# EAGLE design button8x-analog-v1 (EAGLE 8.7.1)
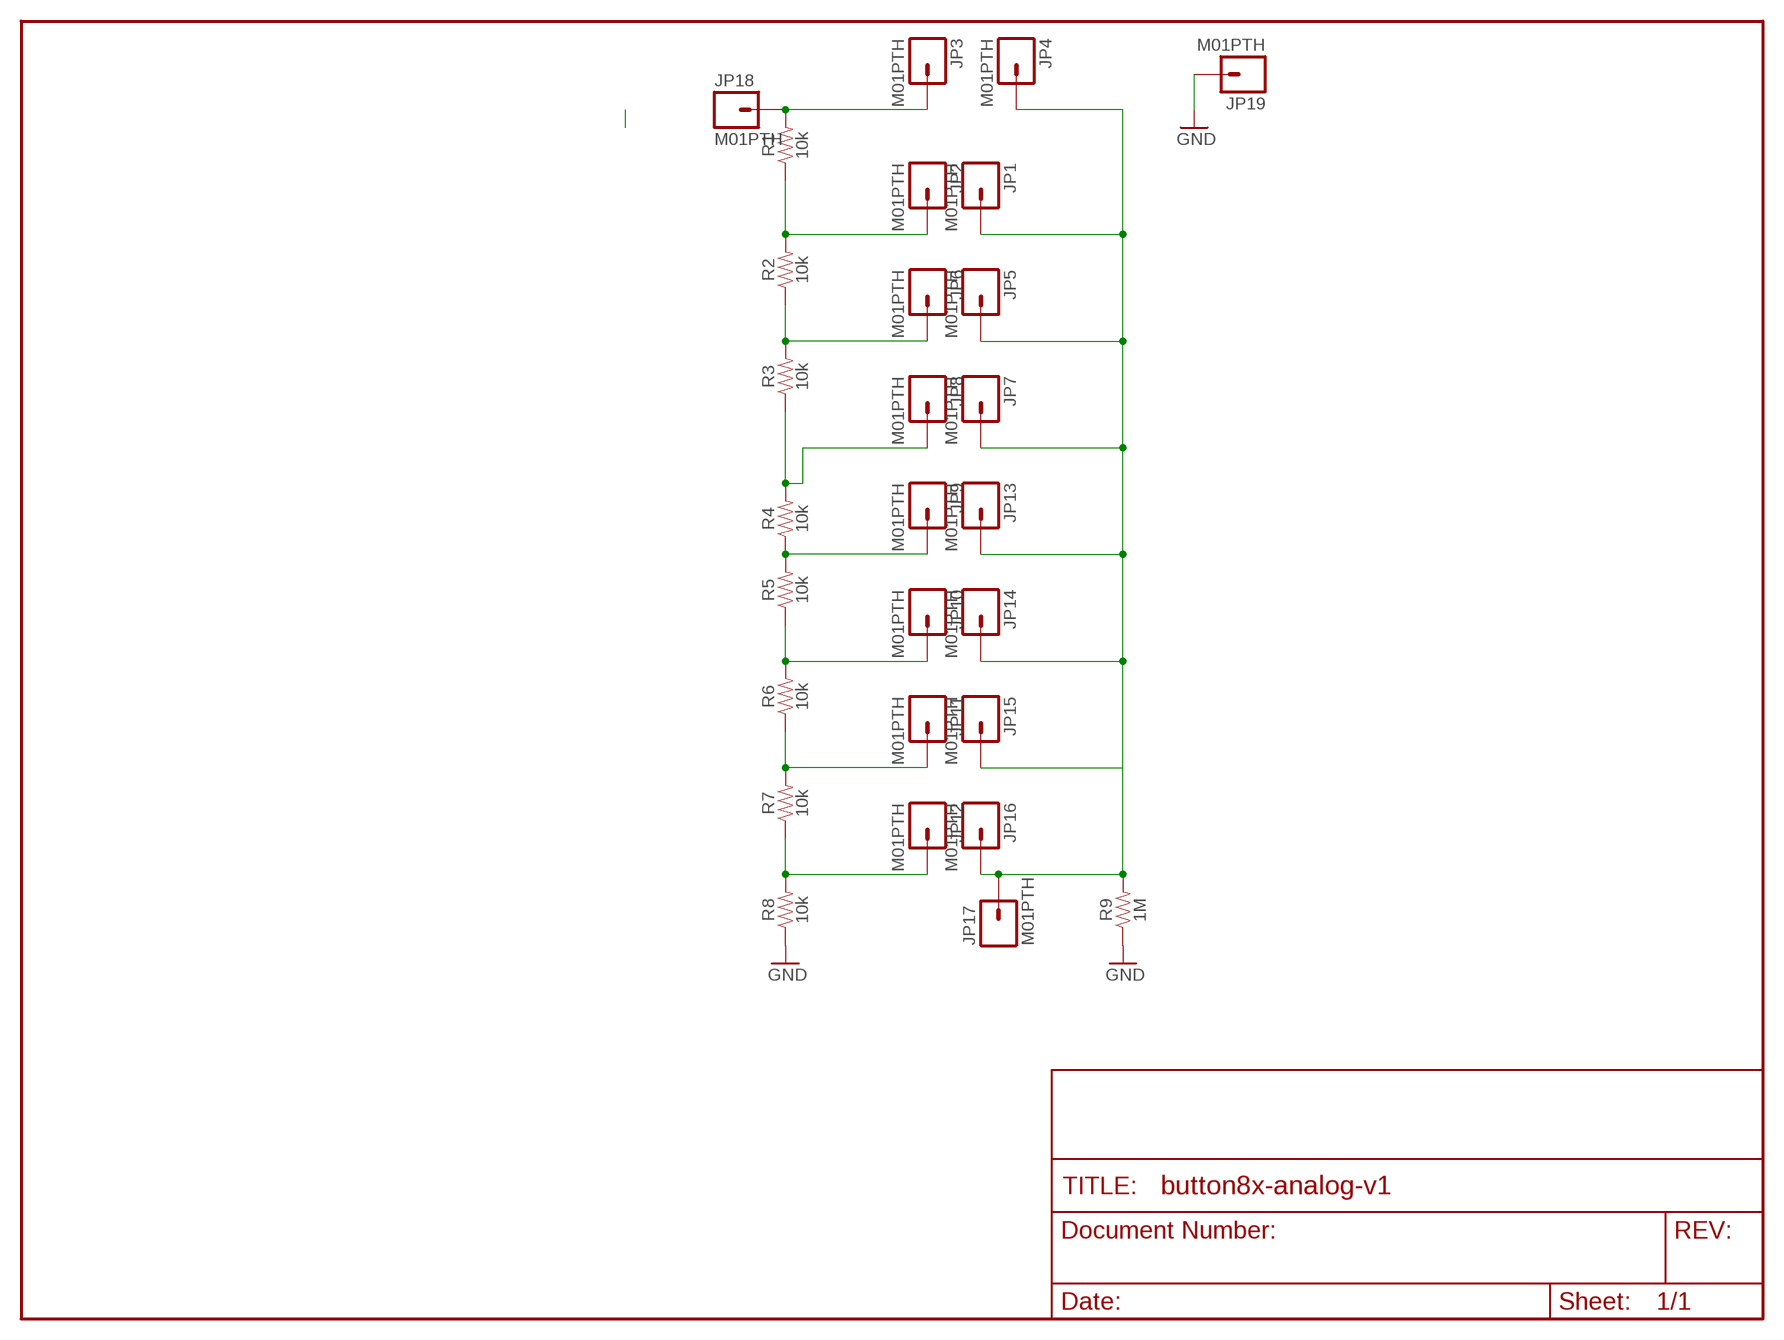
[diagram p0: schematic, sheet 1]

## Parts
JP1  M01PTH  [1X01]
JP2  M01PTH  [1X01]
JP3  M01PTH  [1X01]
JP4  M01PTH  [1X01]
JP5  M01PTH  [1X01]
JP6  M01PTH  [1X01]
JP7  M01PTH  [1X01]
JP8  M01PTH  [1X01]
JP9  M01PTH  [1X01]
JP10  M01PTH  [1X01]
JP11  M01PTH  [1X01]
JP12  M01PTH  [1X01]
JP13  M01PTH  [1X01]
JP14  M01PTH  [1X01]
JP15  M01PTH  [1X01]
JP16  M01PTH  [1X01]
JP17  M01PTH  [1X01]
JP18  M01PTH  [1X01]
JP19  M01PTH  [1X01]
R1  10k  10KOHM-0603-1/10W-1%  [0603]
R2  10k  10KOHM-0603-1/10W-1%  [0603]
R3  10k  10KOHM-0603-1/10W-1%  [0603]
R4  10k  10KOHM-0603-1/10W-1%  [0603]
R5  10k  10KOHM-0603-1/10W-1%  [0603]
R6  10k  10KOHM-0603-1/10W-1%  [0603]
R7  10k  10KOHM-0603-1/10W-1%  [0603]
R8  10k  10KOHM-0603-1/10W-1%  [0603]
R9  1M  10KOHM-0603-1/10W-1%  [0603]

## Nets
ANALOG: JP1.1 JP4.1 JP5.1 JP7.1 JP13.1 JP14.1 JP15.1 JP16.1 JP17.1 R9.2
GND: JP19.1 R8.1 R9.1
N$4: JP2.1 R1.1 R2.2
N$5: JP6.1 R2.1 R3.2
N$6: JP8.1 R3.1 R4.2
N$7: JP9.1 R4.1 R5.2
N$9: JP11.1 R6.1 R7.2
N$10: JP12.1 R7.1 R8.2
N$11: JP10.1 R5.1 R6.2
VCC: JP3.1 JP18.1 R1.2

## Library data of the parts
JP1-JP19 = SparkFun-Connectors:M01: Header 1 Standard 1-pin 0.1" header. Use with straight break away headers (SKU : PRT-00116), right angle break away headers (PRT-00553), swiss pins (PRT-00743), machine pins (PRT-00117), and female headers (PRT-00115).
R1-R8 = SparkFun-Resistors:10KOHM: 10kΩ resistor A resistor is a passive two-terminal electrical component that implements electrical resistance as a circuit element. Resistors act to reduce current flow, and, at the same time, act to lower voltage levels within circuits. - Wikipedia; PROD_ID: RES-00824
R9 = SparkFun-Resistors:10KOHM: 10kΩ resistor A resistor is a passive two-terminal electrical component that implements electrical resistance as a circuit element. Resistors act to reduce current flow, and, at the same time, act to lower voltage levels within circuits. - Wikipedia; PROD_ID: RES-00824; VALUE: 10k

## Net classes
0 default: width 0.203 mm
1 vcc: width 0.254 mm

## Board
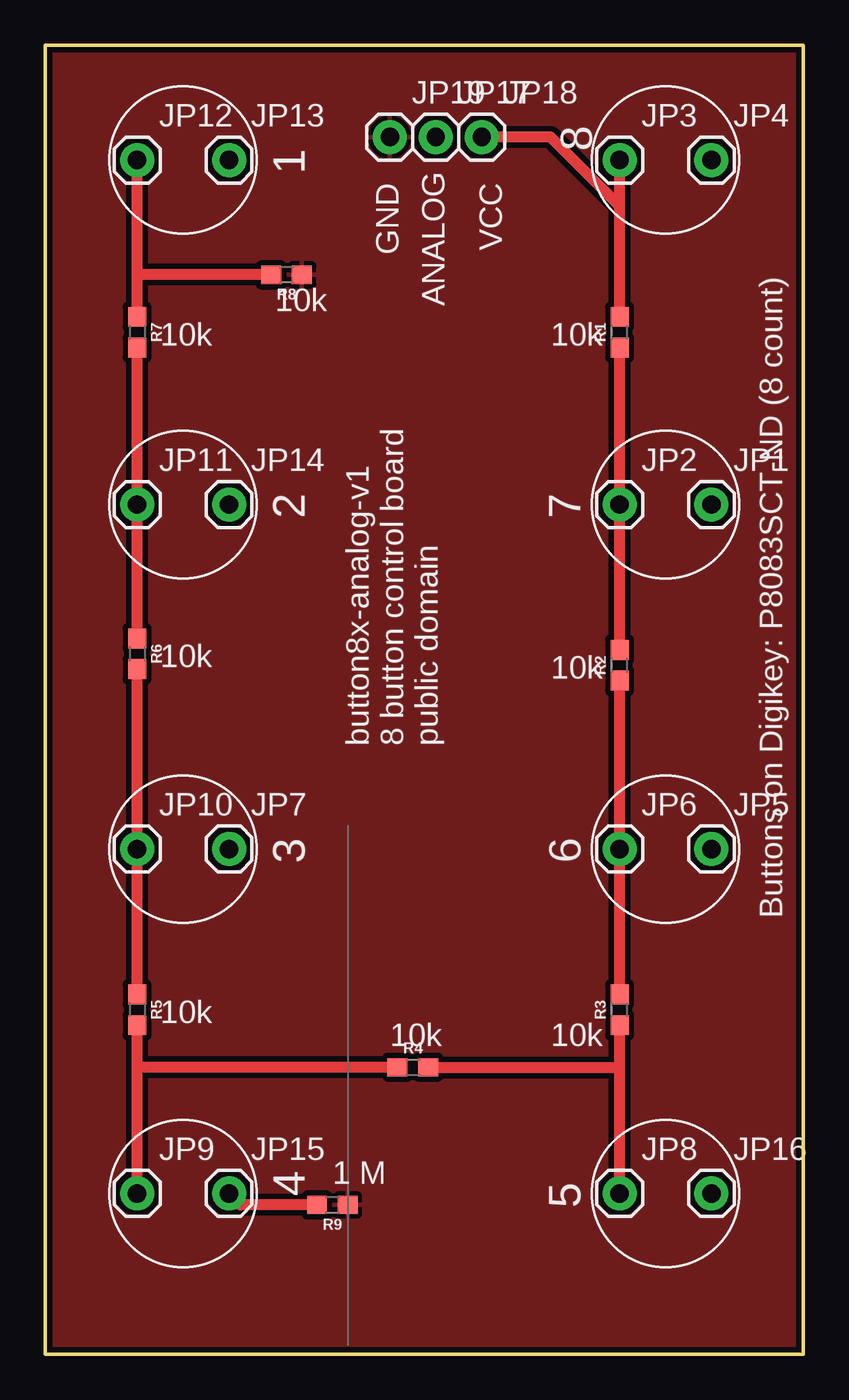
[diagram p1: board, top side]
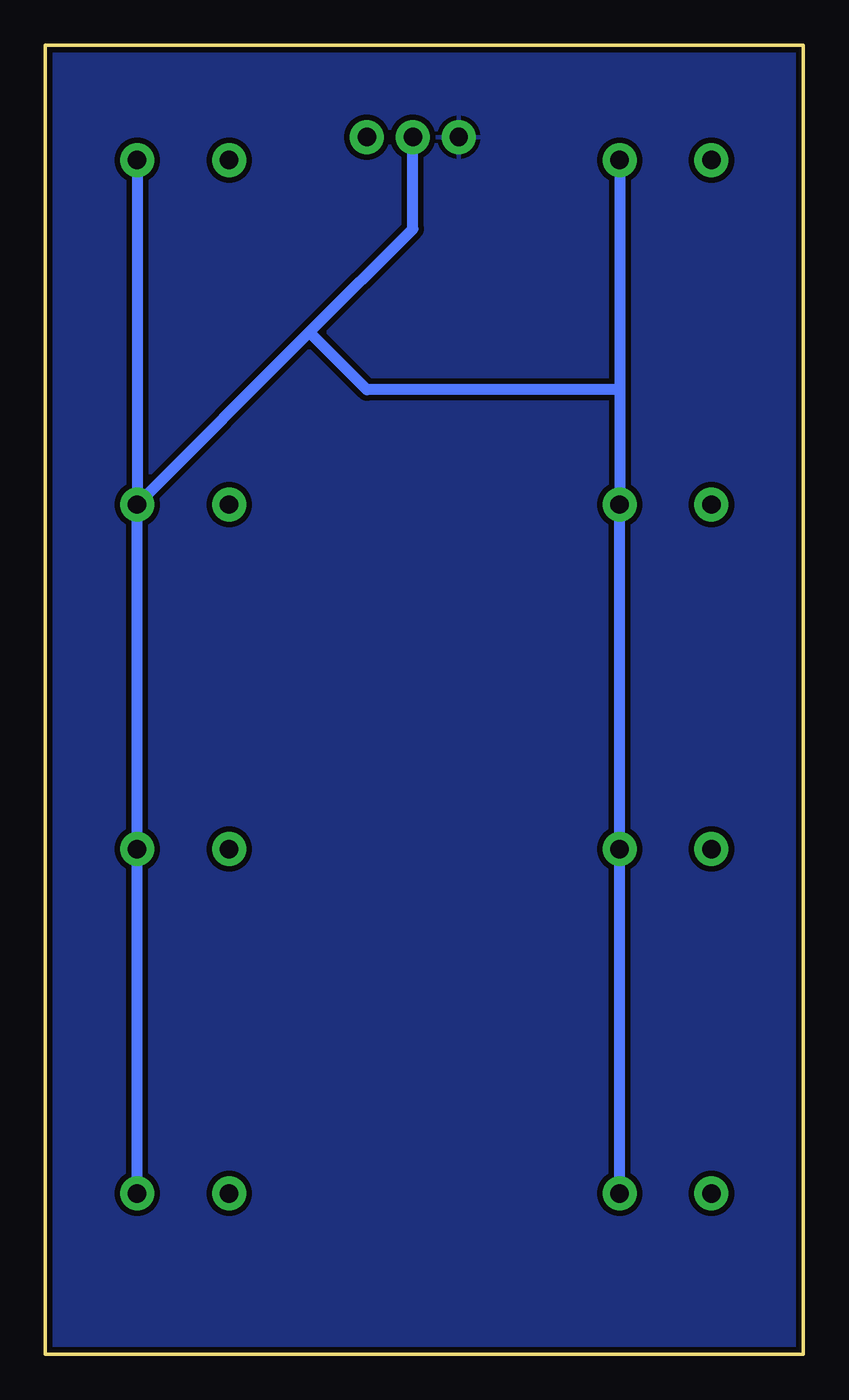
[diagram p2: board, bottom side, seen from below]

Size 41.91 x 72.39 mm. Coordinates in mm from the lower left corner, seen from the top.
Outline: 0,72.39 0,0 41.91,0 41.91,72.39 0,72.39
Copper layers (1*16): Top 0.035mm / dielectric 1.5mm / Bottom 0.035mm
Design rules "default": minimum track width 8mil, minimum drill 20mil, track to track 8mil, track to pad 8mil, pad to pad 8mil, via to via 8mil, smd to smd 8mil, copper to edge 10mil, drill to drill 8mil, minimum pad ring 12mil, minimum via ring 10mil, stop-mask expansion 4mil, vias tented up to drill 25mil, thermal gap 10mil

### Footprints (pad centres in the part's own frame; a part is rotated, then mirrored left to right if it is on the bottom)
1X01 = drill 1.016 pad 1.88: 1 0,0
0603 = smd 1.1 x 1: 1 -0.85,0; 2 0.85,0

### Placement (x,y rotation side)
JP1  36.83,46.99 0 top
JP2  31.75,46.99 0 top
JP3  31.75,66.04 0 top
JP4  36.83,66.04 0 top
JP5  36.83,27.94 0 top
JP6  31.75,27.94 0 top
JP7  10.16,27.94 0 top
JP8  31.75,8.89 0 top
JP9  5.08,8.89 0 top
JP10  5.08,27.94 0 top
JP11  5.08,46.99 0 top
JP12  5.08,66.04 0 top
JP13  10.16,66.04 0 top
JP14  10.16,46.99 0 top
JP15  10.16,8.89 0 top
JP16  36.83,8.89 0 top
JP17  21.59,67.31 0 top
JP18  24.13,67.31 0 top
JP19  19.05,67.31 0 top
R1  31.75,56.52 90 top
R2  31.75,38.1 90 top
R3  31.75,19.05 90 top
R4  20.32,15.88 0 top
R5  5.08,19.05 270 top
R6  5.08,38.73 270 top
R7  5.08,56.52 270 top
R8  13.33,59.69 180 top
R9  15.88,8.26 180 top

### Tracks (layer width: path | path; a pad name or v marks a point on that pad's centre or on a via)
ANALOG
  Top 0.61: R9.2 10.79,8.26 JP15.1
  Bottom 0.61: JP15.1 JP7.1 JP14.1 10.16,53.34 | JP16.1 JP5.1 JP1.1 | JP1.1 27.3,56.52 | 27.3,56.52 21.59,62.23 JP17.1 | JP4.1 JP1.1 | JP13.1 10.16,53.34 | 10.16,53.34 24.13,53.34 27.3,56.52
GND
  pour Top (isolate 0.305): 0,72.39 41.91,72.39 41.91,0 0,0
  pour Bottom (isolate 0.305): 0,72.39 41.91,72.39 41.91,0 0,0
N$4
  Top 0.61: R2.2 JP2.1 R1.1
N$5
  Top 0.61: R3.2 JP6.1 R2.1
N$6
  Top 0.61: JP8.1 31.75,15.88 | 31.75,15.88 R3.1 | R4.2 31.75,15.88
N$7
  Top 0.61: JP9.1 5.08,15.88 | 5.08,15.88 R5.2 | R4.1 5.08,15.88
N$9
  Top 0.61: R6.1 JP11.1 R7.2
N$10
  Top 0.61: R7.1 5.08,59.69 | 5.08,59.69 JP12.1 | R8.2 5.08,59.69
N$11
  Top 0.61: R5.1 JP10.1 R6.2
VCC
  Top 0.61: R1.2 31.75,63.5 | 31.75,63.5 JP3.1 | 31.75,63.5 27.94,67.31 JP18.1

### Text on the board
tPlace: 8 | 1 | GND | ANALOG | VCC | 10k | 10k | 10k | 2 | 7 | 10k | 10k | button8x-analog-v1 / 8 button control board / public domain | 3 | 6 | Buttons on Digikey: P8083SCT-ND (8 count) | 10k | 10k | 10k | 4 | 5 | 1 M
tValues: Tent Vias! | Arduino Wee v1.3